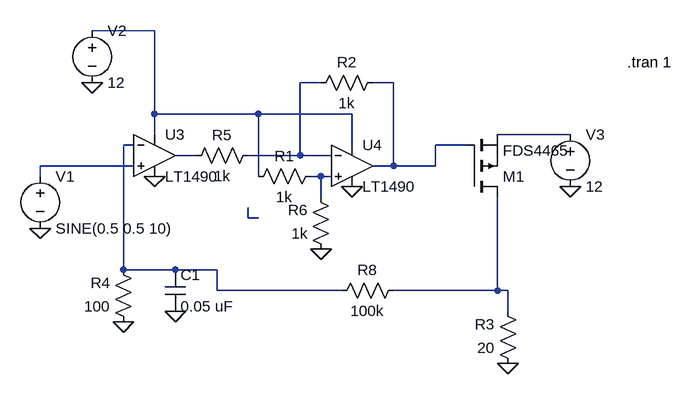
[diagram p0: schematic PMOS Simulation.asc]
PMOS Simulation.asc, the LTspice schematic file:
Version 4
SHEET 1 952 680
WIRE 128 64 32 64
WIRE 384 144 352 144
WIRE 496 144 464 144
WIRE 128 192 128 64
WIRE 288 192 128 192
WIRE 432 192 288 192
WIRE 128 224 128 192
WIRE 768 224 656 224
WIRE 96 240 80 240
WIRE 432 240 432 192
WIRE 608 240 560 240
WIRE 192 256 160 256
WIRE 352 256 352 144
WIRE 352 256 272 256
WIRE 400 256 352 256
WIRE 96 272 -48 272
WIRE 496 272 496 144
WIRE 496 272 464 272
WIRE 560 272 560 240
WIRE 560 272 496 272
WIRE -48 288 -48 272
WIRE 288 288 288 192
WIRE 384 288 368 288
WIRE 400 288 384 288
WIRE 384 320 384 288
WIRE 272 352 272 336
WIRE 288 352 272 352
WIRE 80 432 80 240
WIRE 160 432 80 432
WIRE 224 432 160 432
WIRE 224 464 224 432
WIRE 416 464 224 464
WIRE 656 464 656 320
WIRE 656 464 496 464
WIRE 672 464 656 464
WIRE 672 496 672 464
FLAG 128 288 0
FLAG 432 304 0
FLAG 80 512 0
FLAG 672 576 0
FLAG 768 304 0
FLAG 384 400 0
FLAG 32 144 0
FLAG -48 368 0
FLAG 160 496 0
SYMBOL res 384 272 R90
WINDOW 0 0 56 VBottom 2
WINDOW 3 32 56 VTop 2
SYMATTR InstName R1
SYMATTR Value 1k
SYMBOL res 480 128 R90
WINDOW 0 0 56 VBottom 2
WINDOW 3 32 56 VTop 2
SYMATTR InstName R2
SYMATTR Value 1k
SYMBOL res 688 592 R180
WINDOW 0 36 76 Left 2
WINDOW 3 36 40 Left 2
SYMATTR InstName R3
SYMATTR Value 20
SYMBOL res 96 528 R180
WINDOW 0 36 76 Left 2
WINDOW 3 36 40 Left 2
SYMATTR InstName R4
SYMATTR Value 100
SYMBOL res 176 272 R270
WINDOW 0 32 56 VTop 2
WINDOW 3 0 56 VBottom 2
SYMATTR InstName R5
SYMATTR Value 1k
SYMBOL res 400 416 R180
WINDOW 0 36 76 Left 2
WINDOW 3 36 40 Left 2
SYMATTR InstName R6
SYMATTR Value 1k
SYMBOL res 400 480 R270
WINDOW 0 32 56 VTop 2
WINDOW 3 0 56 VBottom 2
SYMATTR InstName R8
SYMATTR Value 100k
SYMBOL voltage -48 272 R0
SYMATTR InstName V1
SYMATTR Value SINE(0.5 0.5 10)
SYMBOL voltage 32 48 R0
SYMATTR InstName V2
SYMATTR Value 12
SYMBOL voltage 768 208 R0
SYMATTR InstName V3
SYMATTR Value 12
SYMBOL Opamps/LT1490 128 192 R0
SYMATTR InstName U3
SYMBOL Opamps/LT1490 432 208 R0
SYMATTR InstName U4
SYMBOL pmos 608 320 M180
SYMATTR InstName M1
SYMATTR Value FDS4465
SYMBOL cap 144 432 R0
SYMATTR InstName C1
SYMATTR Value 0.05 uF
TEXT 856 112 Left 2 !.tran 1

The netlist it stands for:
* PMOS Simulation.asc
R1 N008 N001 1k
R2 N003 N002 1k
R3 0 N010 20
R4 0 N005 100
R5 N006 N002 1k
R6 0 N008 1k
R8 N005 N010 100k
V1 N007 0 SINE(0.5 0.5 10)
V2 N001 0 12
V3 N004 0 12
XU3 N007 N005 N001 0 N006 LT1490  ; pins In+ In- V+ V- OUT
XU4 N008 N002 N001 0 N003 LT1490  ; pins In+ In- V+ V- OUT
M1 N010 N003 N004 N004 FDS4465
C1 N005 0 0.05 uF
.model NMOS NMOS
.model PMOS PMOS
.lib standard.mos
.tran 1
.backanno
.end